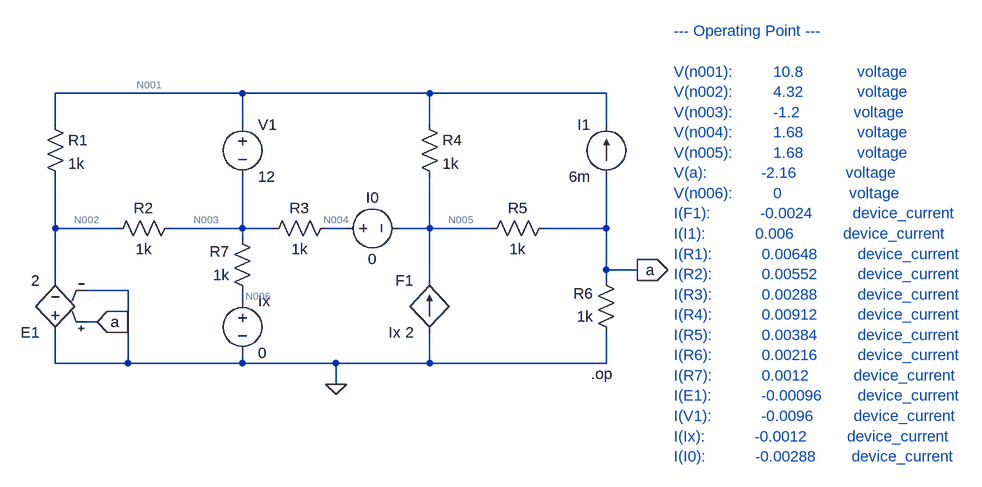
[diagram p0: schematic Q4.asc]
Q4.asc, the LTspice schematic file:
Version 4
SHEET 1 1388 680
WIRE 240 16 -48 16
WIRE 528 16 240 16
WIRE 800 16 528 16
WIRE -48 64 -48 16
WIRE 240 64 240 16
WIRE 528 64 528 16
WIRE 800 64 800 16
WIRE -48 224 -48 144
WIRE 48 224 -48 224
WIRE 240 224 240 144
WIRE 240 224 128 224
WIRE 288 224 240 224
WIRE 400 224 368 224
WIRE 528 224 528 144
WIRE 528 224 480 224
WIRE 624 224 528 224
WIRE 800 224 800 144
WIRE 800 224 704 224
WIRE 240 240 240 224
WIRE 800 288 800 224
WIRE 848 288 800 288
WIRE -48 304 -48 224
WIRE 528 304 528 224
WIRE 800 304 800 288
WIRE 64 320 0 320
WIRE 240 336 240 320
WIRE 16 368 0 368
WIRE -48 432 -48 384
WIRE 64 432 64 320
WIRE 64 432 -48 432
WIRE 240 432 240 416
WIRE 240 432 64 432
WIRE 384 432 240 432
WIRE 528 432 528 384
WIRE 528 432 384 432
WIRE 800 432 800 384
WIRE 800 432 528 432
WIRE 384 464 384 432
FLAG 384 464 0
FLAG 16 368 a
IOPIN 16 368 In
FLAG 848 288 a
IOPIN 848 288 Out
SYMBOL res -64 48 R0
SYMATTR InstName R1
SYMATTR Value 1k
SYMBOL res 32 240 R270
WINDOW 0 32 56 VTop 2
WINDOW 3 0 56 VBottom 2
SYMATTR InstName R2
SYMATTR Value 1k
SYMBOL voltage 240 48 R0
SYMATTR InstName V1
SYMATTR Value 12
SYMBOL res 384 208 R90
WINDOW 0 0 56 VBottom 2
WINDOW 3 32 56 VTop 2
SYMATTR InstName R3
SYMATTR Value 1k
SYMBOL res 512 48 R0
SYMATTR InstName R4
SYMATTR Value 1k
SYMBOL res 608 240 R270
WINDOW 0 32 56 VTop 2
WINDOW 3 0 56 VBottom 2
SYMATTR InstName R5
SYMATTR Value 1k
SYMBOL current 800 144 R180
WINDOW 0 24 80 Left 2
WINDOW 3 24 0 Left 2
SYMATTR InstName I1
SYMATTR Value 6m
SYMBOL res 816 400 R180
WINDOW 0 36 76 Left 2
WINDOW 3 36 40 Left 2
SYMATTR InstName R6
SYMATTR Value 1k
SYMBOL f 528 384 R180
WINDOW 0 24 80 Left 2
WINDOW 3 24 0 Left 2
SYMATTR InstName F1
SYMATTR Value Ix 2
SYMBOL res 256 336 R180
WINDOW 0 36 76 Left 2
WINDOW 3 36 40 Left 2
SYMATTR InstName R7
SYMATTR Value 1k
SYMBOL e -48 400 R180
SYMATTR InstName E1
SYMATTR Value 2
SYMBOL voltage 240 320 R0
SYMATTR InstName Ix
SYMATTR Value 0
SYMBOL voltage 384 224 R270
WINDOW 0 32 56 VTop 2
WINDOW 3 -32 56 VBottom 2
SYMATTR InstName I0
SYMATTR Value 0
TEXT 776 448 Left 2 !.op
TEXT 904 -80 Left 2 ;--- Operating Point ---\n \nV(n001):         10.8            voltage\nV(n002):         4.32            voltage\nV(n003):         -1.2            voltage\nV(n004):         1.68            voltage\nV(n005):         1.68            voltage\nV(a):            -2.16           voltage\nV(n006):         0               voltage\nI(F1):           -0.0024         device_current\nI(I1):           0.006           device_current\nI(R1):           0.00648         device_current\nI(R2):           0.00552         device_current\nI(R3):           0.00288         device_current\nI(R4):           0.00912         device_current\nI(R5):           0.00384         device_current\nI(R6):           0.00216         device_current\nI(R7):           0.0012          device_current\nI(E1):           -0.00096        device_current\nI(V1):           -0.0096         device_current\nI(Ix):           -0.0012         device_current\nI(I0):           -0.00288        device_current

The netlist it stands for:
* Q4.asc
R1 N001 N002 1k
R2 N002 N003 1k
V1 N001 N003 12
R3 N004 N003 1k
R4 N001 N005 1k
R5 N005 a 1k
I1 a N001 6m
R6 0 a 1k
F1 0 N005 Ix 2
R7 N006 N003 1k
E1 0 N002 a 0 2
V§Ix N006 0 0
V§I0 N004 N005 0
.op
* --- Operating Point ---
* V(n001):         10.8            voltage
* V(n002):         4.32            voltage
* V(n003):         -1.2            voltage
* V(n004):         1.68            voltage
* V(n005):         1.68            voltage
* V(a):            -2.16           voltage
* V(n006):         0               voltage
* I(F1):           -0.0024         device_current
* I(I1):           0.006           device_current
* I(R1):           0.00648         device_current
* I(R2):           0.00552         device_current
* I(R3):           0.00288         device_current
* I(R4):           0.00912         device_current
* I(R5):           0.00384         device_current
* I(R6):           0.00216         device_current
* I(R7):           0.0012          device_current
* I(E1):           -0.00096        device_current
* I(V1):           -0.0096         device_current
* I(Ix):           -0.0012         device_current
* I(I0):           -0.00288        device_current
.backanno
.end

* Results of the author's LTspice run, read from the files saved beside the schematic
* Operating Point:
*   V(n001) = 10.8 V
*   V(n002) = 4.32 V
*   V(n003) = -1.2 V
*   V(n004) = 1.68 V
*   V(n005) = 1.68 V
*   V(a) = -2.16 V
*   V(n006) = 0 V
*   I(F1) = -2.4 mA
*   I(I1) = 6 mA
*   I(R1) = 6.48 mA
*   I(R2) = 5.52 mA
*   I(R3) = 2.88 mA
*   I(R4) = 9.12 mA
*   I(R5) = 3.84 mA
*   I(R6) = 2.16 mA
*   I(R7) = 1.2 mA
*   I(E1) = -960 µA
*   I(V1) = -9.6 mA
*   I(Ix) = -1.2 mA
*   I(I0) = -2.88 mA